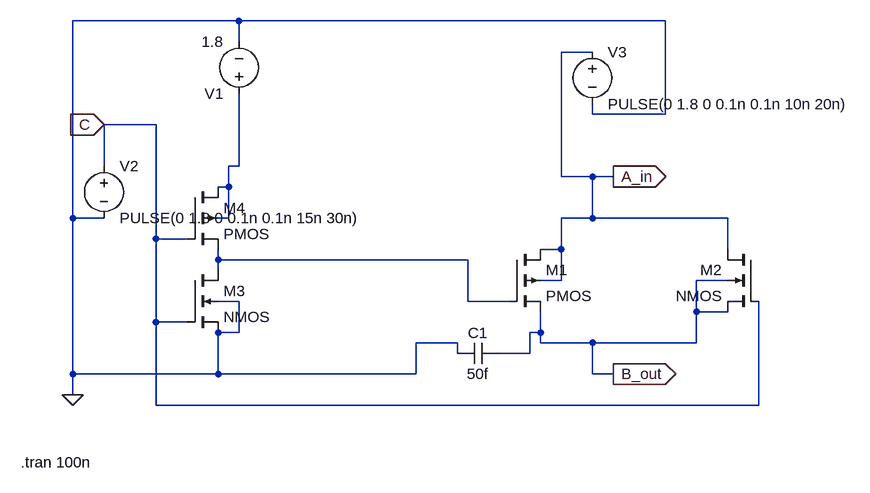
[diagram p0: schematic transmession.asc]
transmession.asc, the LTspice schematic file:
Version 4.1
SHEET 1 904 680
WIRE -368 -240 -624 -240
WIRE 288 -240 -368 -240
WIRE -368 -208 -368 -240
WIRE 176 -192 128 -192
WIRE 176 -96 176 -112
WIRE 288 -96 288 -240
WIRE 288 -96 176 -96
WIRE -496 -80 -576 -80
WIRE -576 -16 -576 -80
WIRE -368 -16 -368 -128
WIRE -368 -16 -384 -16
WIRE 128 0 128 -192
WIRE 176 0 128 0
WIRE 208 0 176 0
WIRE -384 16 -384 -16
WIRE -384 16 -400 16
WIRE -624 64 -624 -240
WIRE -576 64 -624 64
WIRE -384 64 -384 16
WIRE -384 64 -400 64
WIRE 176 64 176 0
WIRE 176 64 128 64
WIRE 384 64 176 64
WIRE -496 96 -496 -80
WIRE -448 96 -496 96
WIRE 128 112 128 64
WIRE 128 112 96 112
WIRE 384 112 384 64
WIRE -400 128 -400 112
WIRE -16 128 -400 128
WIRE -400 144 -400 128
WIRE 128 160 128 112
WIRE 128 160 96 160
WIRE 384 160 336 160
WIRE -368 192 -400 192
WIRE -16 192 -16 128
WIRE 48 192 -16 192
WIRE 336 208 336 160
WIRE 384 208 336 208
WIRE -496 224 -496 96
WIRE -448 224 -496 224
WIRE -368 240 -368 192
WIRE -368 240 -400 240
WIRE 96 240 96 208
WIRE 96 240 80 240
WIRE -32 256 -96 256
WIRE 96 256 96 240
WIRE 176 256 96 256
WIRE 336 256 336 208
WIRE 336 256 176 256
WIRE -32 272 -32 256
WIRE 80 272 80 240
WIRE 80 272 32 272
WIRE -624 304 -624 64
WIRE -400 304 -400 240
WIRE -400 304 -624 304
WIRE -96 304 -96 256
WIRE -96 304 -400 304
WIRE 176 304 176 256
WIRE 208 304 176 304
WIRE -624 336 -624 304
WIRE -496 352 -496 224
WIRE 432 352 432 192
WIRE 432 352 -496 352
FLAG -576 -80 C
IOPIN -576 -80 In
FLAG 208 304 B_out
IOPIN 208 304 Out
FLAG 208 0 A_in
IOPIN 208 0 Out
FLAG -624 336 0
SYMBOL pmos4 48 112 R0
SYMATTR InstName M1
SYMATTR Value2 l=180n w=810n
SYMBOL nmos4 432 112 M0
SYMATTR InstName M2
SYMATTR Value2 l=180n w=270n
SYMBOL nmos4 -448 144 R0
SYMATTR InstName M3
SYMATTR Value2 l=180n w=270n
SYMBOL pmos4 -448 16 R0
SYMATTR InstName M4
SYMBOL voltage -368 -112 R180
WINDOW 123 0 0 Left 0
WINDOW 39 0 0 Left 0
SYMATTR InstName V1
SYMATTR Value 1.8
SYMBOL voltage -576 -32 R0
WINDOW 123 0 0 Left 0
WINDOW 39 0 0 Left 0
SYMATTR InstName V2
SYMATTR Value PULSE(0 1.8 0 0.1n 0.1n 15n 30n)
SYMBOL voltage 176 -208 R0
WINDOW 123 0 0 Left 0
WINDOW 39 0 0 Left 0
SYMATTR InstName V3
SYMATTR Value PULSE(0 1.8 0 0.1n 0.1n 10n 20n)
SYMBOL cap 32 256 R90
WINDOW 0 0 32 VBottom 2
WINDOW 3 32 32 VTop 2
SYMATTR InstName C1
SYMATTR Value 50f
TEXT -704 440 Left 2 !.tran 100n

The netlist it stands for:
* transmession.asc
M1 A_in N002 B_out A_in PMOS l=180n w=810n
M2 A_in C B_out B_out NMOS l=180n w=270n
M3 N002 C 0 0 NMOS l=180n w=270n
M4 N001 C N002 N001 PMOS
V1 N001 0 1.8
V2 C 0 PULSE(0 1.8 0 0.1n 0.1n 15n 30n)
V3 A_in 0 PULSE(0 1.8 0 0.1n 0.1n 10n 20n)
C1 B_out 0 50f
.model NMOS NMOS
.model PMOS PMOS
.lib standard.mos
.tran 100n
.backanno
.end